# EAGLE design lcd13264-module-template (EAGLE 6.5.0)
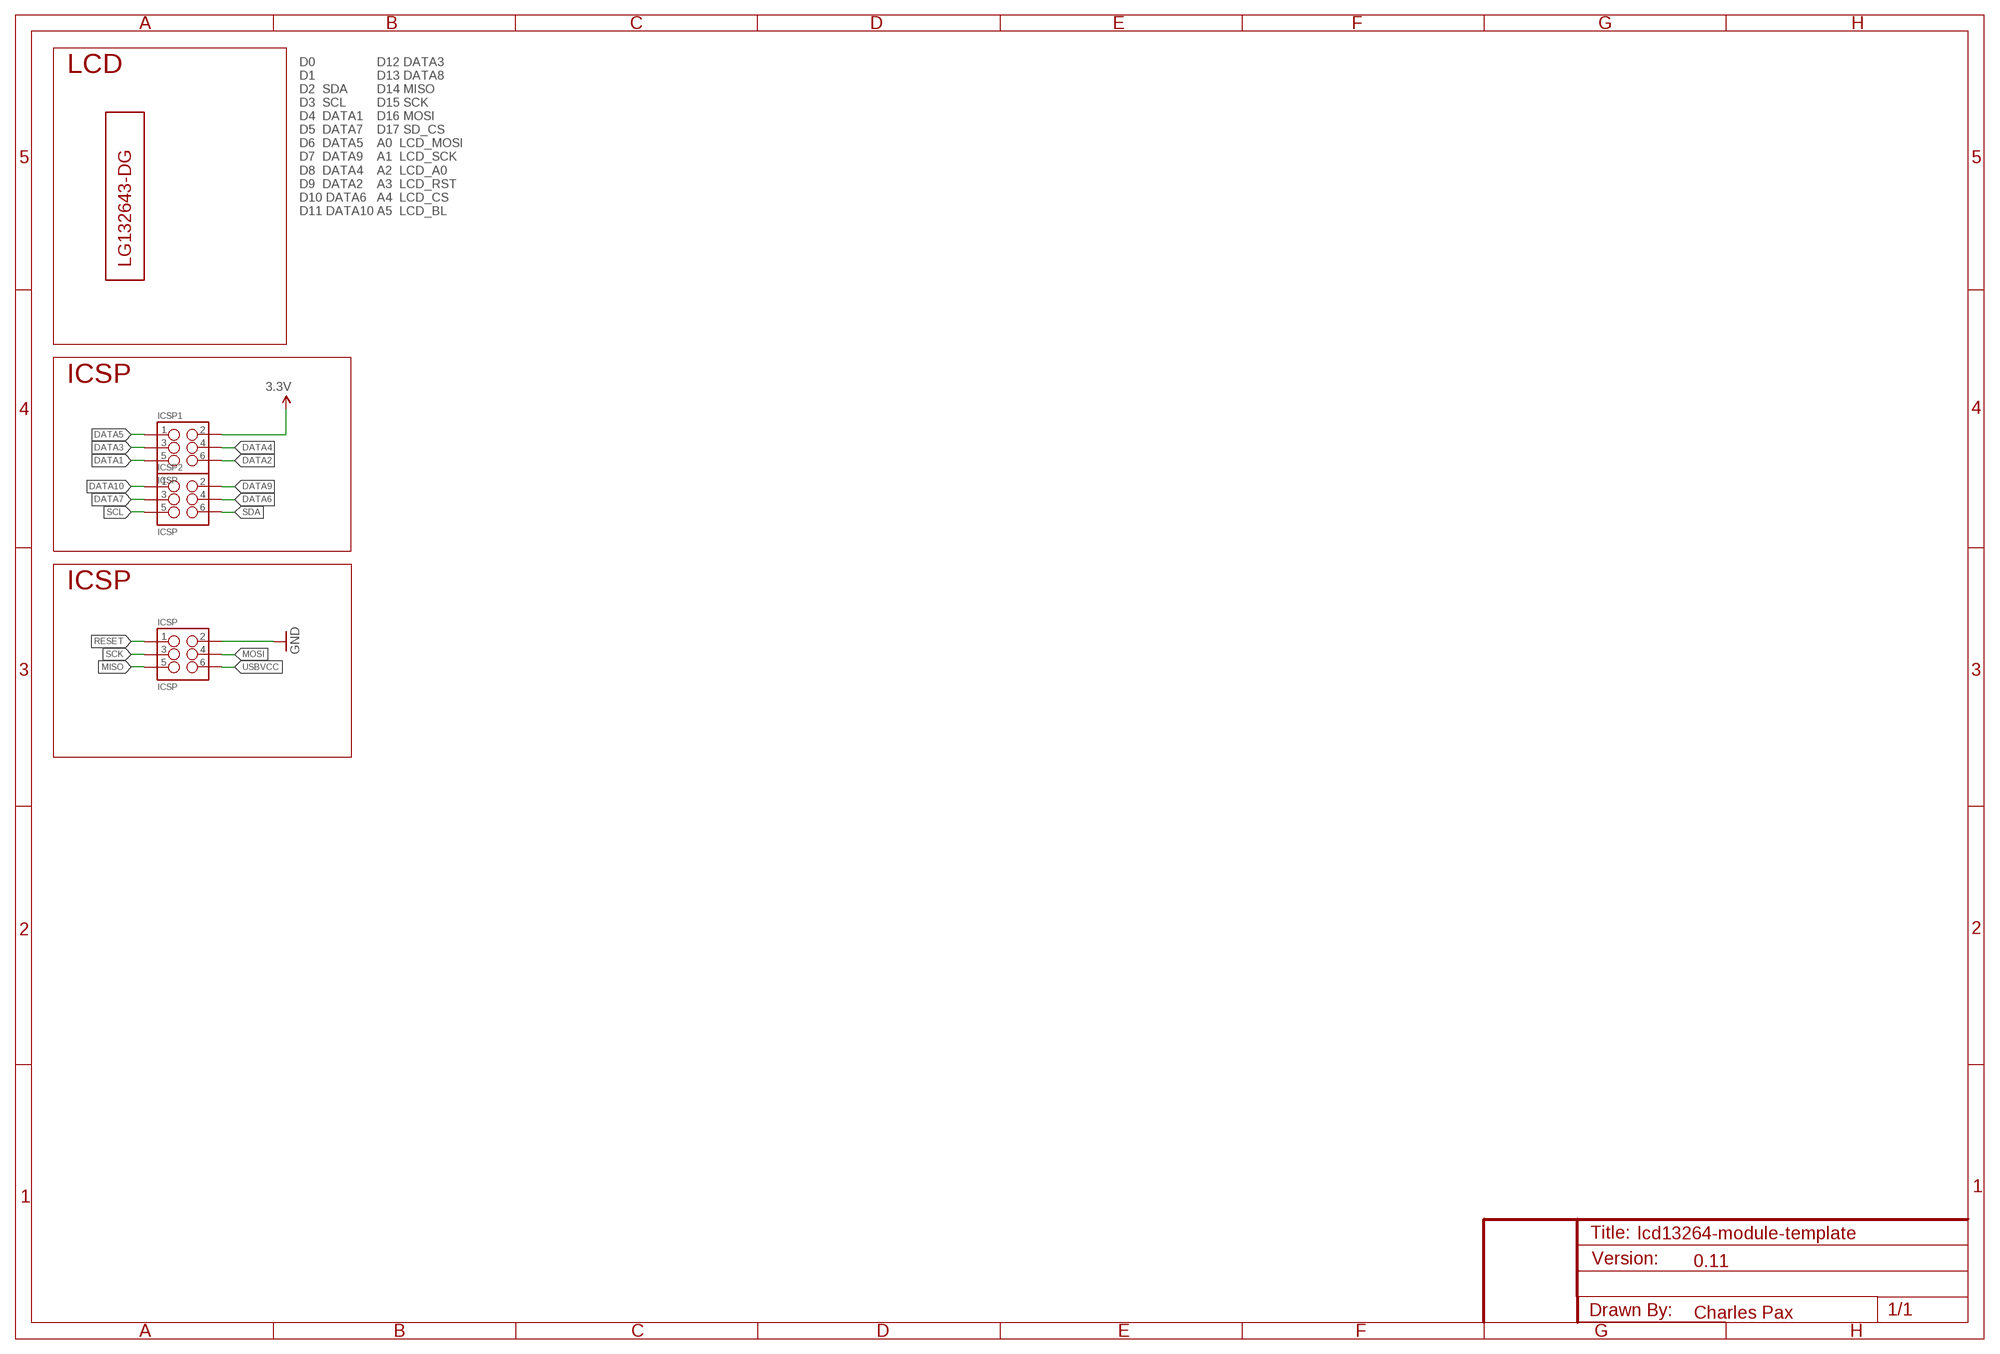
[diagram p0: schematic, sheet 1]

## Parts
ICSP  ICSP  SPARKFUN-CONNECTORS_M03X2PAX  [SPARKFUN-CONNECTORS_2X3_SMT_POSTS_PAXINSTRUMENT]
ICSP1  ICSP  SPARKFUN-CONNECTORS_M03X2PAX  [SPARKFUN-CONNECTORS_2X3_SMT_POSTS_PAXINSTRUMENT]
ICSP2  ICSP  SPARKFUN-CONNECTORS_M03X2PAX  [SPARKFUN-CONNECTORS_2X3_SMT_POSTS_PAXINSTRUMENT]
U$5  LG132643-DG  [LG132643-DG]

## Nets
3.3V: ICSP1.2
DATA1: ICSP1.5
DATA2: ICSP1.6
DATA3: ICSP1.3
DATA4: ICSP1.4
DATA5: ICSP1.1
DATA6: ICSP2.4
DATA7: ICSP2.3
DATA9: ICSP2.2
DATA10: ICSP2.1
GND: ICSP.2
MISO: ICSP.5
MOSI: ICSP.4
RESET: ICSP.1
SCK: ICSP.3
SCL: ICSP2.5
SDA: ICSP2.6
USBVCC: ICSP.6

## Notes on the sheet
- LCD
- D0
  D1
  D2  SDA
  D3  SCL
  D4  DATA1
  D5  DATA7
  D6  DATA5
  D7  DATA9
  D8  DATA4
  D9  DATA2
  D10 DATA6
  D11 DATA10
- D12 DATA3
  D13 DATA8
  D14 MISO
  D15 SCK
  D16 MOSI
  D17 SD_CS
  A0  LCD_MOSI
  A1  LCD_SCK
  A2  LCD_A0
  A3  LCD_RST
  A4  LCD_CS
  A5  LCD_BL
- ICSP
- ICSP
- 0.11
- Charles Pax

## Library data of the parts
ICSP ICSP1 ICSP2 = PaxInstrument-T400:SPARKFUN-CONNECTORS_M03X2: 2x3 .1" header. Shrouded, with keying- CONN-10681 SMT- CONN-11415 Pogo pins- HW-11044; MPN: 95278-101A06LF; OC_DIGIKEY: 609-3487-2-ND
U$5 = charlespax:LG132643-DG; MPN: LG132643-DW

## Net classes
0 default: width 0.203 mm, drill 0.33 mm
1 power: width 0.305 mm

## Board
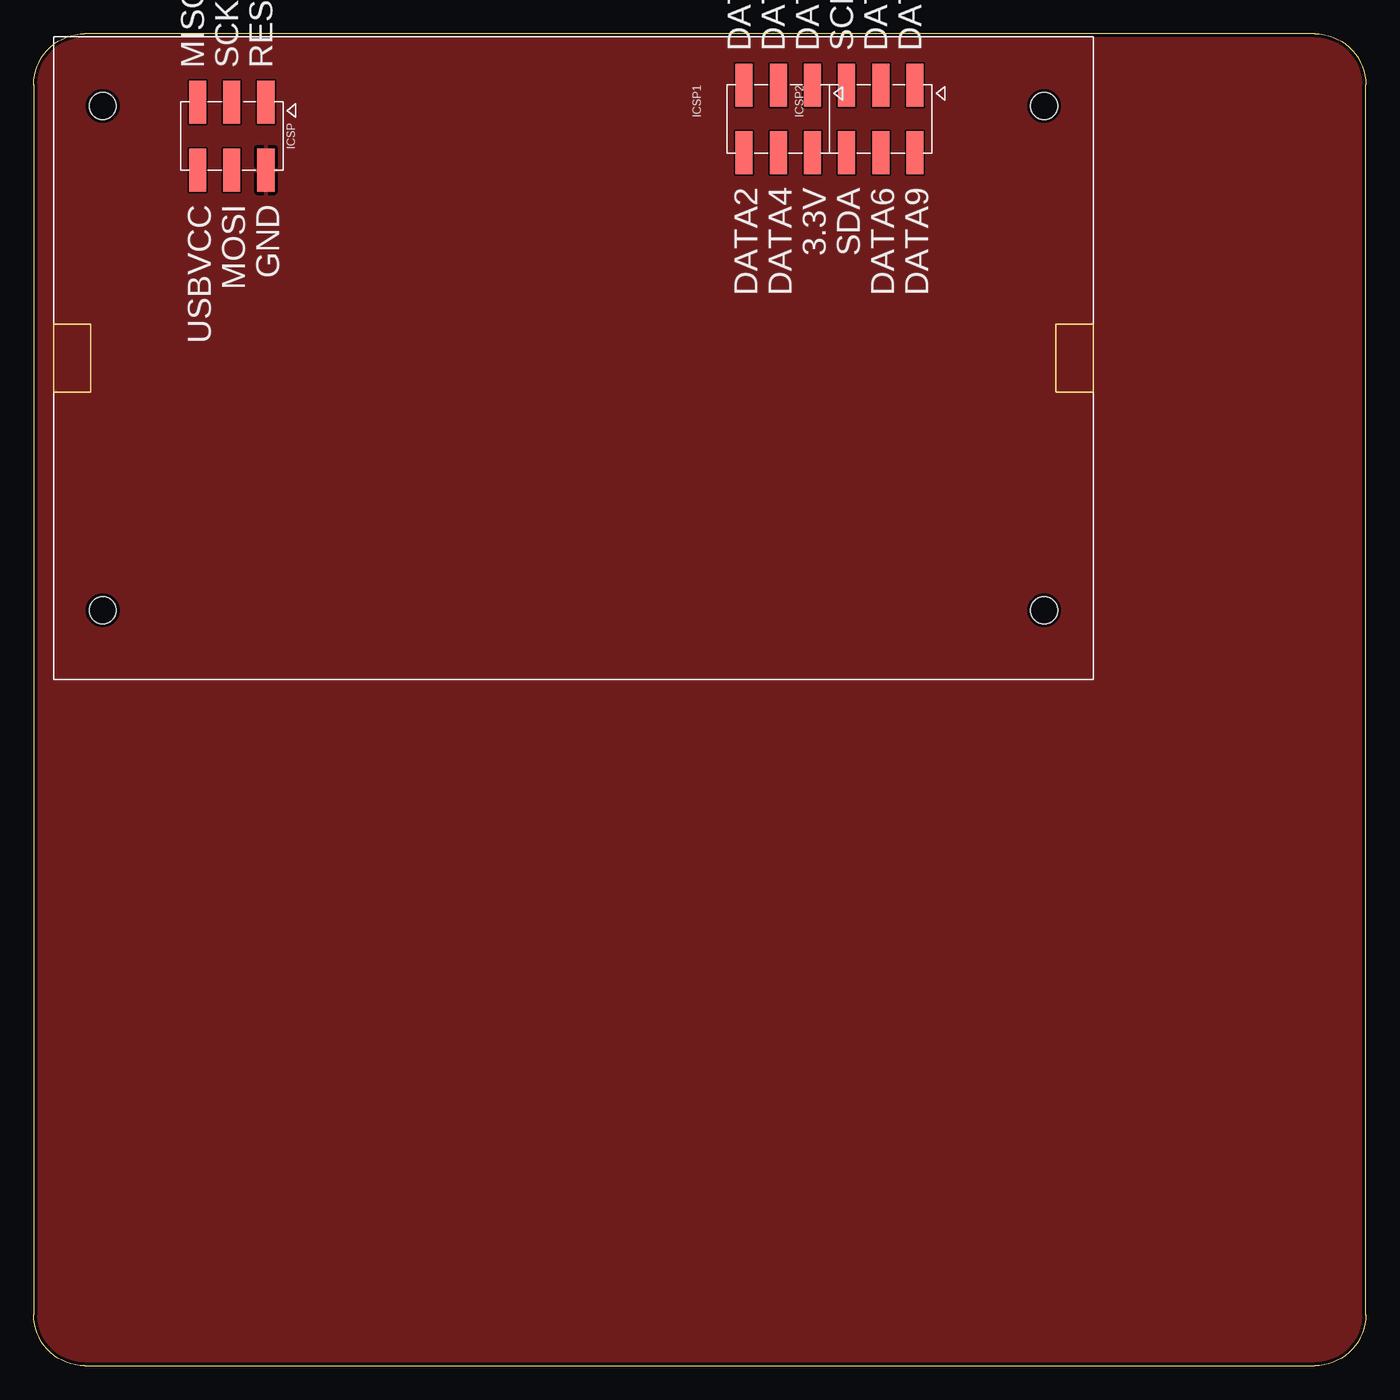
[diagram p1: board, top side]
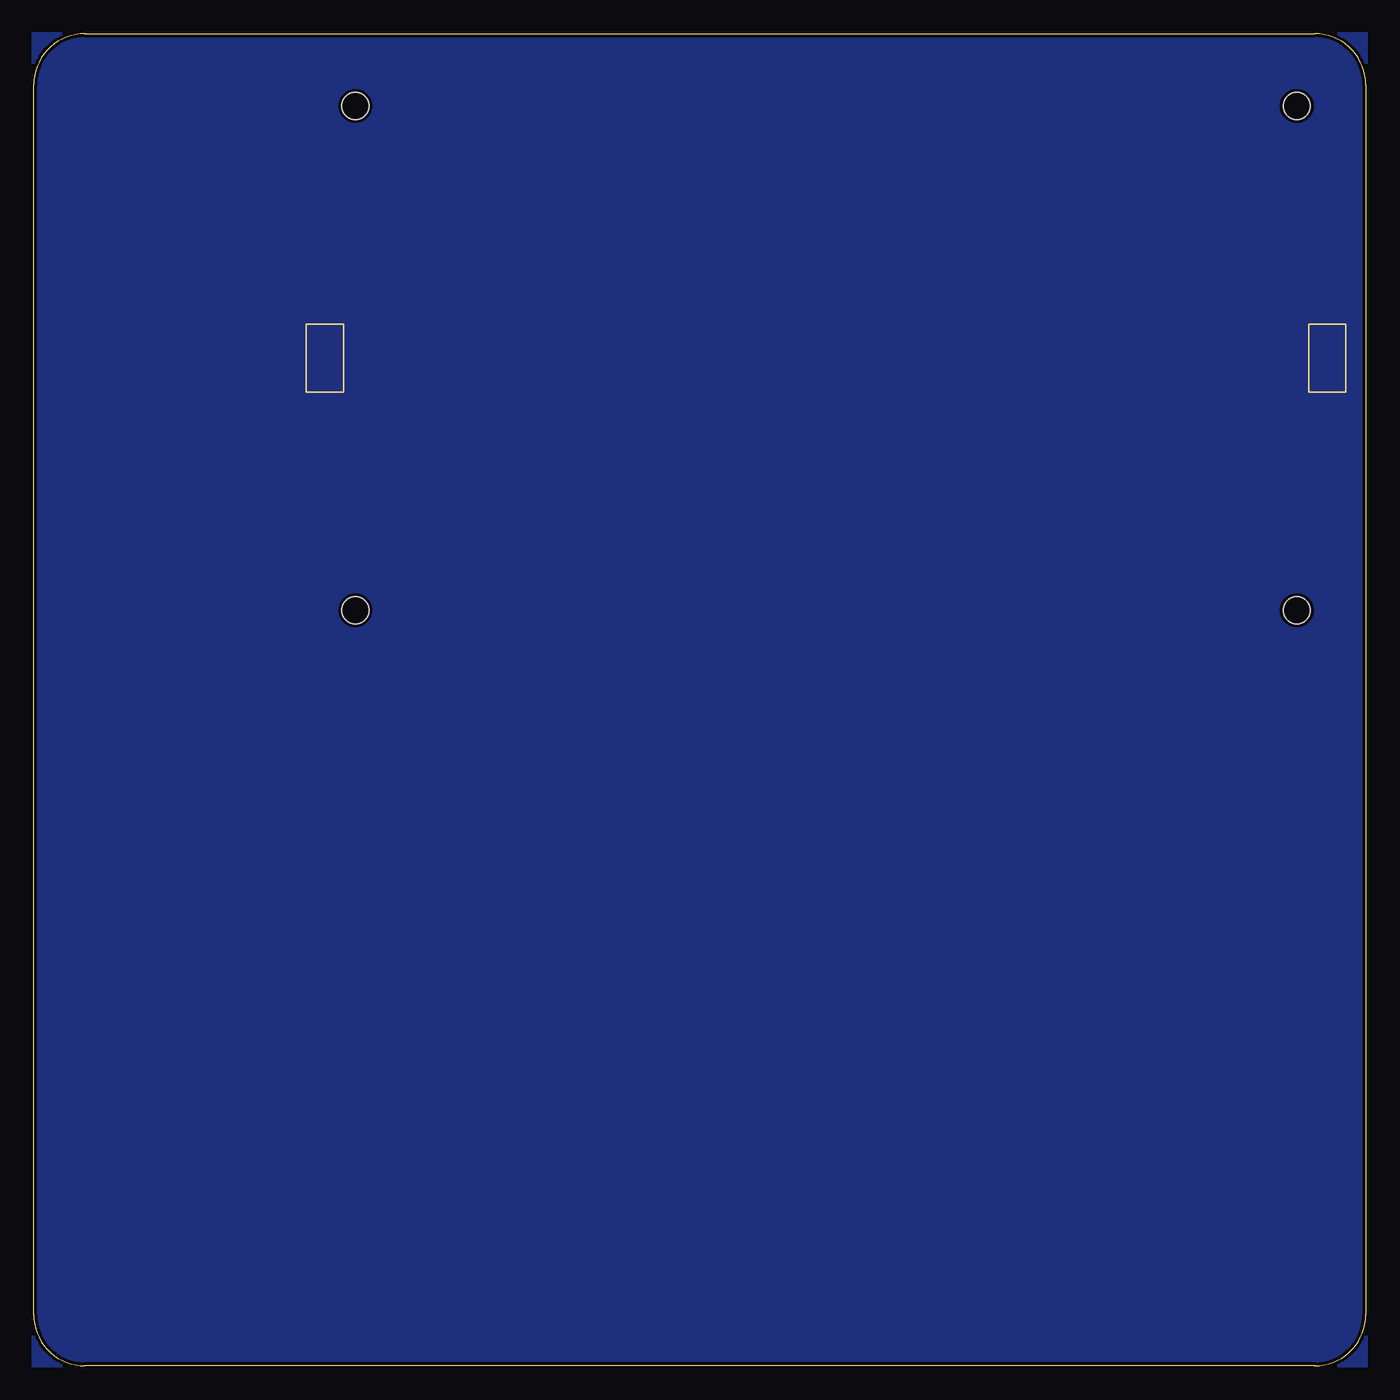
[diagram p2: board, bottom side, seen from below]

Size 99.06 x 99.06 mm. Coordinates in mm from the lower left corner, seen from the top.
Outline: 3.81,0 95.25,0 arc90 99.06,3.81 99.06,95.25 arc90 95.25,99.06 3.81,99.06 arc90 0,95.25 0,3.81 arc90 3.81,0
Copper layers (1*16): Top 0.035mm / dielectric 1.5mm / Bottom 0.035mm
Design rules "PaxInstrument-T400 *": minimum track width 6mil, minimum drill 13mil, track to track 5mil, track to pad 5mil, pad to pad 5mil, via to via 5mil, smd to smd 5mil, copper to edge 10mil, drill to drill 8mil, minimum pad ring 12mil, minimum via ring 10mil, stop-mask expansion 4mil, vias tented up to drill 25mil, thermal gap 10mil

### Footprints (pad centres in the part's own frame; a part is rotated, then mirrored left to right if it is on the bottom)
SPARKFUN-CONNECTORS_2X3_SMT_POSTS_PAXINSTRUMENT = smd 1.27 x 3.2: 1 -2.54,-2.52; 2 -2.54,2.52; 3 0,-2.52; 4 0,2.52; 5 2.54,-2.52; 6 2.54,2.52
LG132643-DG = hole 2: -35,-18.75; 35,-18.75; 35,18.75; -35,18.75

### Placement (x,y rotation side)
ICSP  14.73,91.44 180 top
ICSP1  55.37,92.71 180 top
ICSP2  62.99,92.71 180 top
U$5  40.13,74.93 0 bottom
U$6  [PAXINSTRUMENT_LOGO]  63.5,107.95 0 top  (outside the outline)

### Tracks (layer width: path | path; a pad name or v marks a point on that pad's centre or on a via)
GND
  pour Top: 0,99.06 0,0 99.06,0 99.06,99.06
  pour Bottom: 0,99.06 0,0 99.06,0 99.06,99.06

### Text on the board
tPlace: PAX / INSTRUMENTS | LCD13264-module-temlpate v1 | DATA1 | DATA3 | DATA5 | SCL | DATA7 | DATA10 | MISO | SCK | RESET | DATA2 | DATA4 | 3.3V | SDA | DATA6 | DATA9 | USBVCC | MOSI | GND